# Altium schematic sheet MCU_Platform.SchDoc
size A4; SheetNumber: 1; SheetTotal: 5
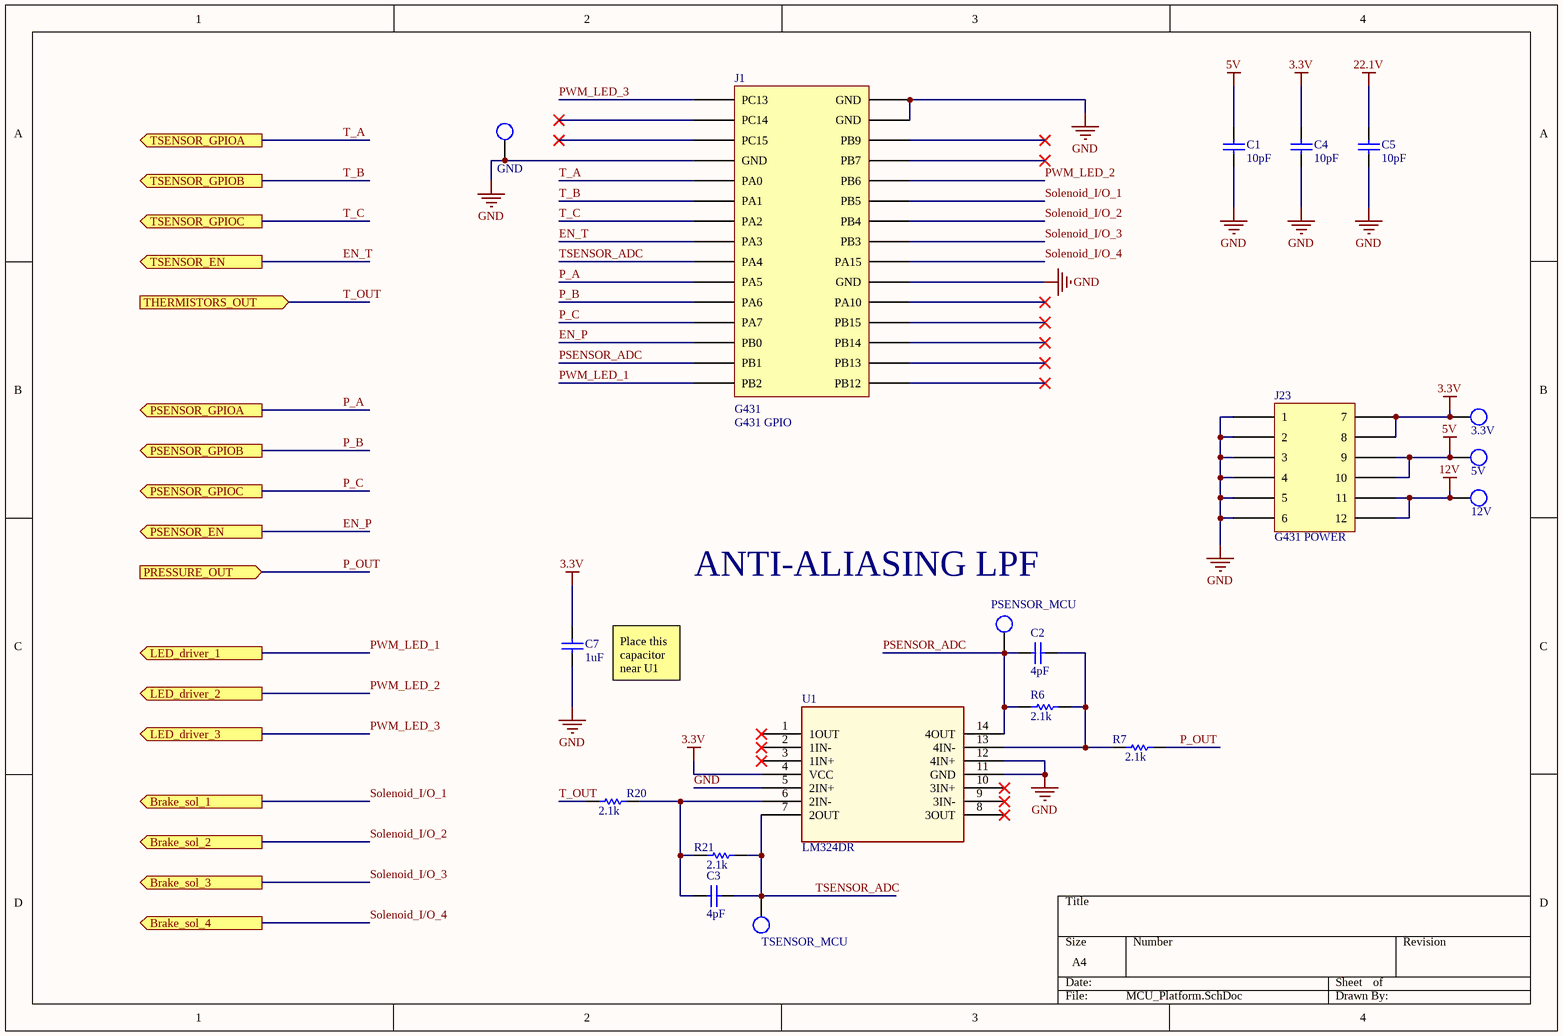
[diagram p0: MCU_Platform.SchDoc]

## Parts
3.3V  Test Point  [Test Point - 5002]  (value not drawn)  (no BOM)
5V  Test Point  [Test Point - 5002]  (value not drawn)  (no BOM)
12V  Test Point  [Test Point - 5002]  (value not drawn)  (no BOM)
C1  value 10pF  [0603 - Capacitor]  (hidden comment: Capacitor - Nonpolarized)
C2  value 4pF  [0603 - Capacitor]  (hidden comment: Capacitor - Nonpolarized)
C3  value 4pF  [0603 - Capacitor]  (hidden comment: Capacitor - Nonpolarized)
C4  value 10pF  [0603 - Capacitor]  (hidden comment: Capacitor - Nonpolarized)
C5  value 10pF  [0603 - Capacitor]  (hidden comment: Capacitor - Nonpolarized)
C7  value 1uF  [0603 - Capacitor]  (hidden comment: Capacitor - Nonpolarized)
GND  Test Point  [Test Point - 5002]  (value not drawn)  (no BOM)
J1  G431 GPIO  [G431 Header (GPIO Connector)]
J23  G431 POWER  [G431 HEADER (POWER CONNECTOR)]
PSENSOR_MCU  Test Point  [Test Point - 5002]  (value not drawn)  (no BOM)
R6  value 2.1k  [0805 - Resistor]  (hidden comment: Resistor)
R7  value 2.1k  [0805 - Resistor]  (hidden comment: Resistor)
R20  value 2.1k  [0805 - Resistor]  (hidden comment: Resistor)
R21  value 2.1k  [0805 - Resistor]  (hidden comment: Resistor)
TSENSOR_MCU  Test Point  [Test Point - 5002]  (value not drawn)  (no BOM)
U1  LM324DR  [LM324DR]

## Ports
Brake_sol_1 (out), Brake_sol_2 (out), Brake_sol_3 (out), Brake_sol_4 (out), LED_driver_1 (out), LED_driver_2 (out), LED_driver_3 (out), PRESSURE_OUT (in), PSENSOR_EN (out), PSENSOR_GPIOA (out), PSENSOR_GPIOB (out), PSENSOR_GPIOC (out), THERMISTORS_OUT (in), TSENSOR_EN (out), TSENSOR_GPIOA (out), TSENSOR_GPIOB (out), TSENSOR_GPIOC (out)

## Nets
3.3V: 3.3V.1 C4.2 C7.2 J23.7 J23.8 U1.4(VCC)
5V: 5V.1 C1.2 J23.9 J23.10
12V: 12V.1 J23.11 J23.12
22.1V: C5.2
GND: C1.1 C4.1 C5.1 C7.1 GND.1 J1.4(GND) J1.16(GND) J1.17(GND) J1.25(GND) J23.1 J23.2 J23.3 J23.4 J23.5 J23.6 U1.5(2IN+) U1.11(GND) U1.12(4IN+)
EN_P: J1.13(PB0) ; port PSENSOR_EN
EN_T: J1.8(PA3) ; port TSENSOR_EN
P_A: J1.10(PA5) ; port PSENSOR_GPIOA
P_B: J1.11(PA6) ; port PSENSOR_GPIOB
P_C: J1.12(PA7) ; port PSENSOR_GPIOC
P_OUT: R7.2 ; port PRESSURE_OUT
PSENSOR_ADC: C2.1 J1.14(PB1) PSENSOR_MCU.1 R6.1 U1.14(4OUT)
PWM_LED_1: J1.15(PB2) ; port LED_driver_1
PWM_LED_2: J1.20(PB6) ; port LED_driver_2
PWM_LED_3: J1.1(PC13) ; port LED_driver_3
Solenoid_I/O_1: J1.21(PB5) ; port Brake_sol_1
Solenoid_I/O_2: J1.22(PB4) ; port Brake_sol_2
Solenoid_I/O_3: J1.23(PB3) ; port Brake_sol_3
Solenoid_I/O_4: J1.24(PA15) ; port Brake_sol_4
T_A: J1.5(PA0) ; port TSENSOR_GPIOA
T_B: J1.6(PA1) ; port TSENSOR_GPIOB
T_C: J1.7(PA2) ; port TSENSOR_GPIOC
T_OUT: R20.1 ; port THERMISTORS_OUT
TSENSOR_ADC: C3.1 J1.9(PA4) R21.2 TSENSOR_MCU.1 U1.7(2OUT)
NetC2_2: C2.2 R6.2 R7.1 U1.13(4IN-)
NetC3_2: C3.2 R20.2 R21.1 U1.6(2IN-)

Not connected (* = marked no-connect by the designer): J1 2(PC14)* 3(PC15)* 18(PB9)* 19(PB7)* 26(PA10)* 27(PB15)* 28(PB14)* 29(PB13)* 30(PB12)*; U1 1(1OUT)* 2(1IN-)* 3(1IN+)* 8(3OUT)* 9(3IN-)* 10(3IN+)*

## Notes on the sheet
- ANTI-ALIASING LPF
- (near C7) Place this capacitor near U1
- (in symbol G431 GPIO) G431

## Library data of the parts
C1-C5 C7 = Capacitor - Nonpolarized: Nonpolarized Capacitor; Supplier Part Number: *; Supplier: *; Manufacturer: *; Rating: *; Manufacturer Part Number: *
J1 = G431 GPIO: PPPC152LJBN-RC (30 Position Header Connector 0.100" (2.54mm) Through Hole, Right Angle Gold); Manufacturer Name: Sullins Connector Solutions; Manufacturer Part Number (CONN): PPPC152LJBN-RC; Supplier Name: Digikey; Supplier Part Number: S5568-ND
J23 = G431 POWER: PPPC062LJBN-RC (12 Position Header Connector 0.100" (2.54mm) Through Hole, Right Angle Gold); Manufacturer Name: Sullins Connector Solutions; Manufacturer Part Number: PPPC062LJBN-RC; Supplier Name: Digikey; Supplier Part Number: S5559-ND
U1 = LM324DR: General Purpose Amplifier 4 Circuit 14-SOIC; Manufacturer Name: TI; Manufacturer Part Number: LM324DR; Supplier: Digikey; Supplier Part Number: 296-14597-2-ND
R6 R7 R20 R21 = Resistor: Rating: *; Manufacturer Part Number: *; Manufacturer: *; Supplier Part Number: *; Supplier: *